# EAGLE design untitled (EAGLE 5.06)
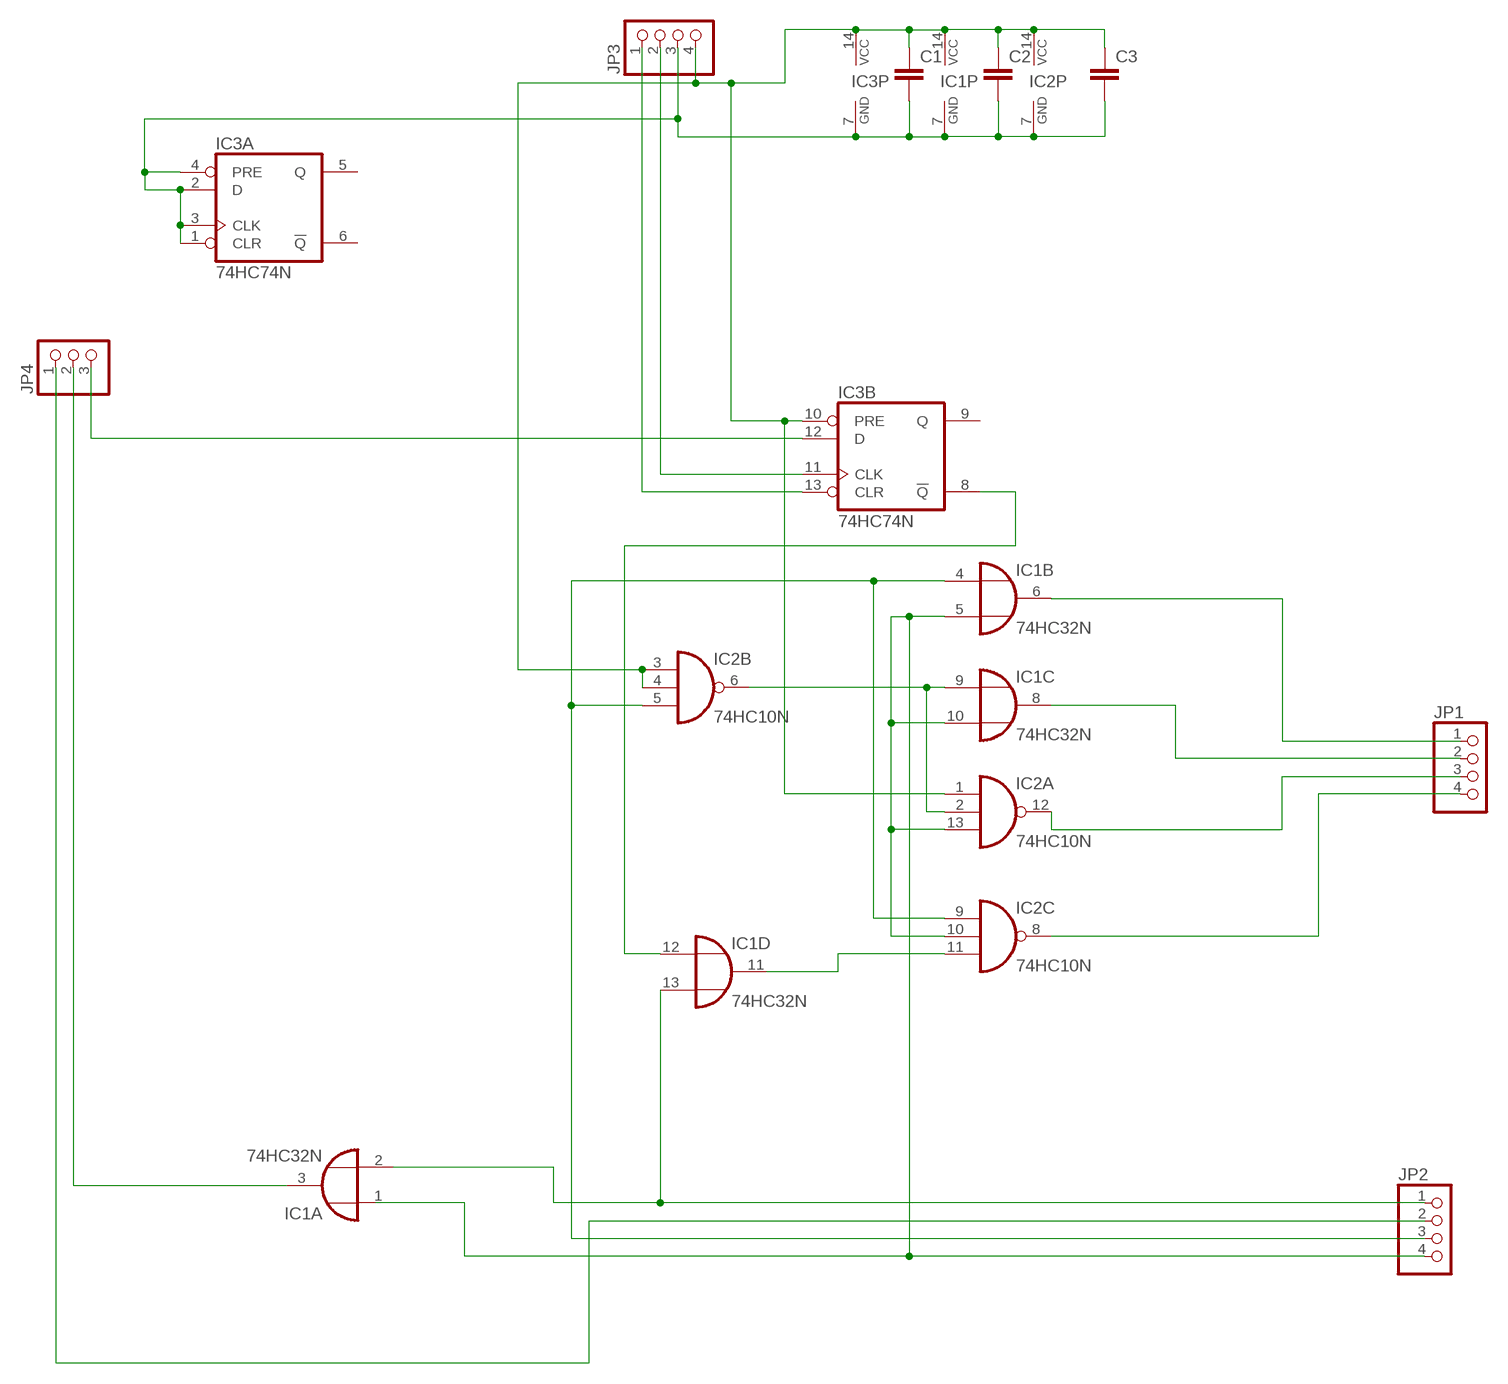
[diagram p0: schematic, sheet 1]

## Parts
C1  C-EU050-030X075  [C050-030X075]
C2  C-EU050-030X075  [C050-030X075]
C3  C-EU050-030X075  [C050-030X075]
IC1  74HC32N  [DIL14]
IC2  74HC10N  [DIL14]
IC3  74HC74N  [DIL14]
JP1  PINHD-1X4  [1X04]
JP2  PINHD-1X4  [1X04]
JP3  PINHD-1X4  [1X04]
JP4  PINHD-1X3  [1X03]

## Nets
N$1: JP2.2 JP4.1
N$2: C1.1 C2.1 C3.1 IC1.14(P:VCC) IC2.1(A:I0) IC2.3(B:I0) IC2.4(B:I1) IC2.14(P:VCC) IC3.10(B:PRE) IC3.14(P:VCC) JP3.4
N$3: C1.2 C2.2 C3.2 IC1.7(P:GND) IC2.7(P:GND) IC3.1(A:CLR) IC3.2(A:D) IC3.3(A:CLK) IC3.4(A:PRE) IC3.7(P:GND) JP3.3
N$4: IC3.11(B:CLK) JP3.2
N$5: IC3.13(B:CLR) JP3.1
N$6: IC3.12(B:D) JP4.3
N$7: IC1.2(A:I1) IC1.13(D:I1) JP2.1
N$8: IC1.3(A:O) JP4.2
N$10: IC1.6(B:O) JP1.1
N$11: IC1.8(C:O) JP1.2
N$12: IC2.12(A:O) JP1.3
N$13: IC2.8(C:O) JP1.4
N$14: IC1.9(C:I0) IC2.2(A:I1) IC2.6(B:O)
N$15: IC1.4(B:I0) IC2.5(B:I2) IC2.9(C:I0) JP2.3
N$16: IC1.12(D:I0) IC3.8(B:!Q)
N$18: IC1.5(B:I1) IC1.10(C:I1) IC2.10(C:I1) IC2.13(A:I2) JP2.4
N$25: IC1.11(D:O) IC2.11(C:I2)
Unconnected: IC1.1(A:I0) IC3.5(A:Q) IC3.6(A:!Q) IC3.9(B:Q)

## Library data of the parts
C1-C3 = resistor:C-EU: CAPACITOR, European symbol
IC1 = 74xx-eu:74*32: Quad 2-input OR gate
IC2 = 74xx-eu:74*10: Triple 3-input NAND gate
IC3 = 74xx-eu:74*74: Dual D type positive edge triggered FLIP FLOP, preset and clear
JP1-JP3 = pinhead:PINHD-1X4: PIN HEADER
JP4 = pinhead:PINHD-1X3: PIN HEADER

## Board
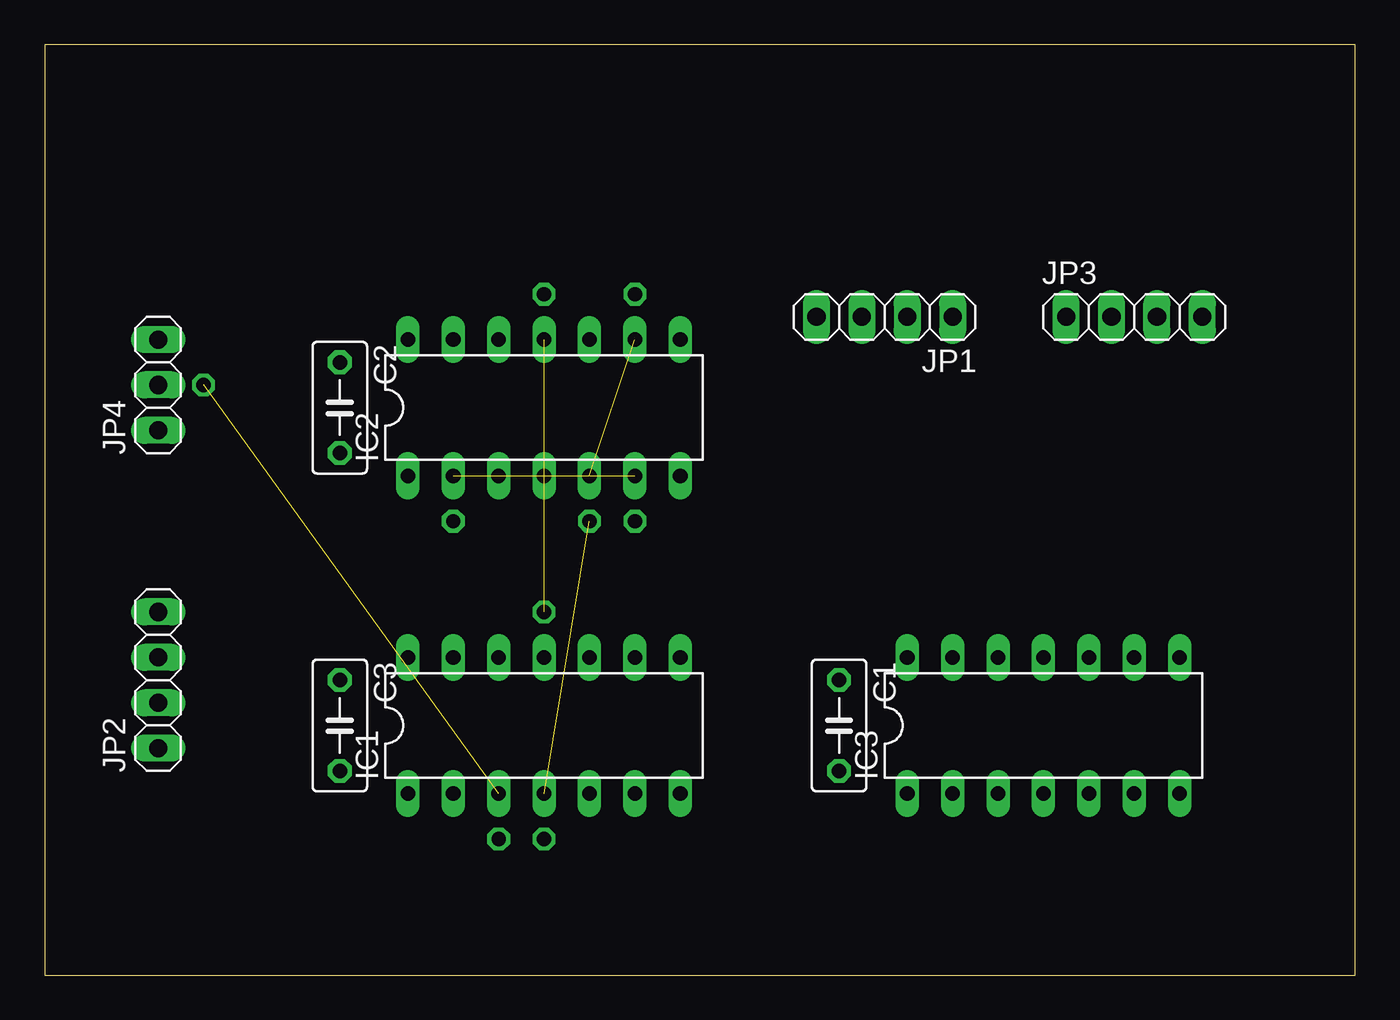
[diagram p1: board, top side]
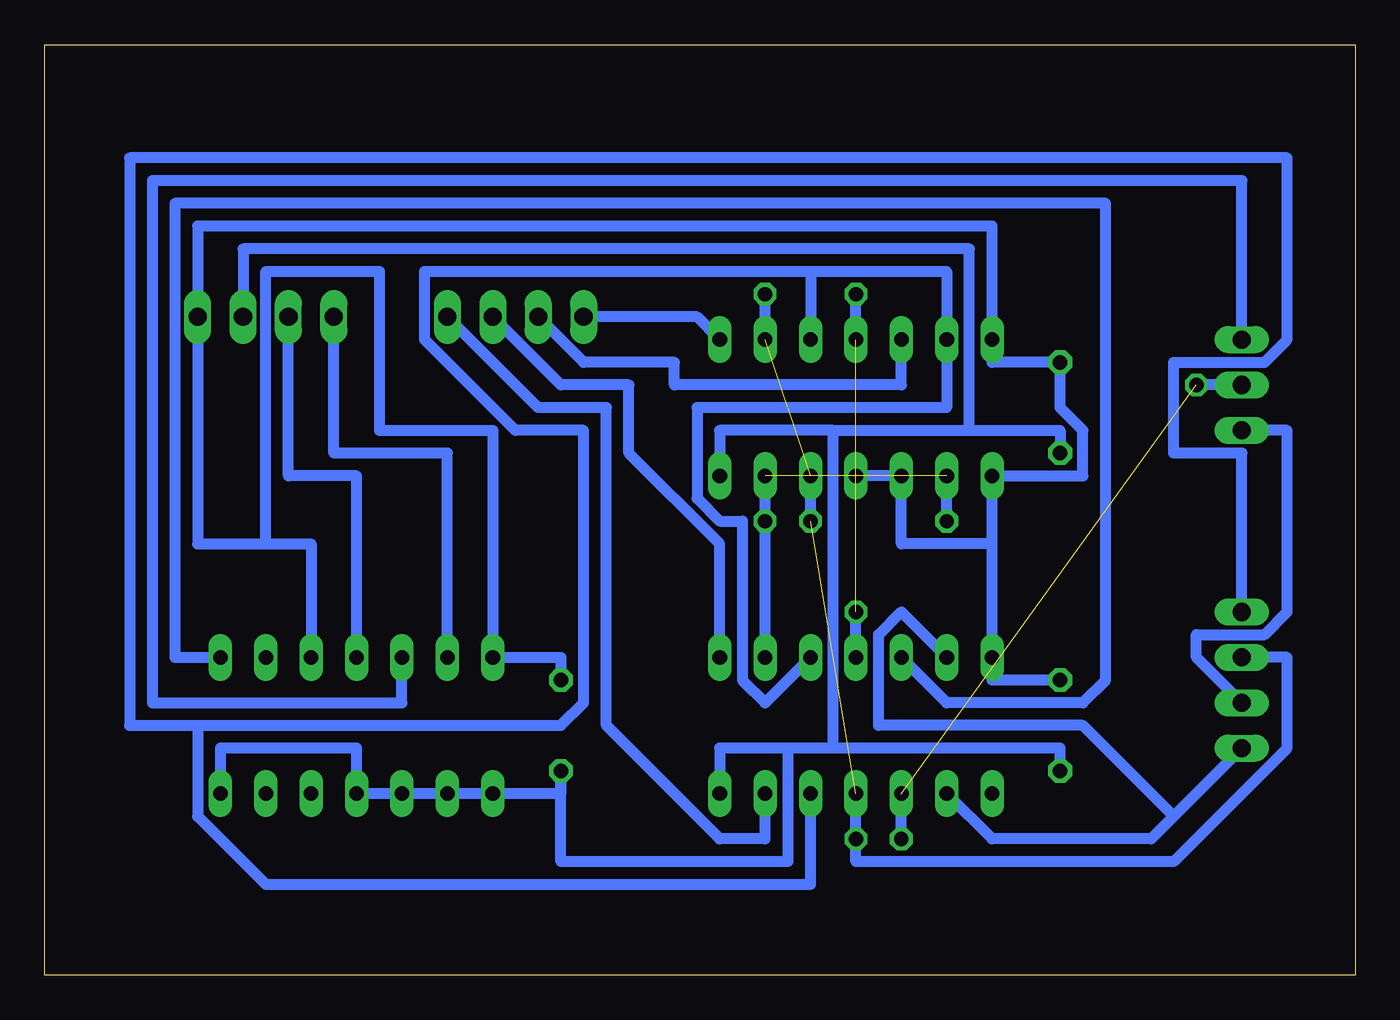
[diagram p2: board, bottom side, seen from below]

Size 73.33 x 52.06 mm. Coordinates in mm from the lower left corner, seen from the top.
Outline: 0,0 73.33,0 73.33,52.06 0,52.06 0,0
Copper layers (1*16): Top 0.035mm / dielectric 1.5mm / Bottom 0.035mm
Design rules "default": minimum track width 10mil, minimum drill 24mil, track to track 8mil, track to pad 8mil, pad to pad 8mil, via to via 8mil, smd to smd 8mil, copper to edge 40mil, drill to drill 8mil, minimum pad ring 10mil, minimum via ring 8mil, stop-mask expansion 4mil, vias tented up to drill 0mil, thermal gap 10mil

### Footprints (pad centres in the part's own frame; a part is rotated, then mirrored left to right if it is on the bottom)
C050-030X075 = drill 0.813 octagon: 1 -2.54,0; 2 2.54,0
DIL14 = drill 0.813 long: 1 -7.62,-3.81; 2 -5.08,-3.81; 3 -2.54,-3.81; 4 0,-3.81; 5 2.54,-3.81; 6 5.08,-3.81; 7 7.62,-3.81; 8 7.62,3.81; 9 5.08,3.81; 10 2.54,3.81; 11 0,3.81; 12 -2.54,3.81; 13 -5.08,3.81; 14 -7.62,3.81
1X04 = drill 1.016 long: 1 -3.81,0; 2 -1.27,0; 3 1.27,0; 4 3.81,0
1X03 = drill 1.016 long: 1 -2.54,0; 2 0,0; 3 2.54,0

### Placement (x,y rotation side)
C1  44.45,13.97 270 top
C2  16.51,31.75 270 top
C3  16.51,13.97 270 top
IC1  27.94,13.97 0 top
IC2  27.94,31.75 0 top
IC3  55.88,13.97 0 top
JP1  46.99,36.83 180 top
JP2  6.35,16.51 90 top
JP3  60.96,36.83 0 top
JP4  6.35,33.02 90 top

### Tracks (layer width: path | path; a pad name or v marks a point on that pad's centre or on a via)
N$1
  Bottom 0.61: JP2.2 8.89,17.78 8.89,19.05 5.08,19.05 3.81,20.32 3.81,30.48 JP4.1
N$2
  Bottom 0.61: C3.1 20.32,16.51 IC1.14 20.32,24.13 | C1.1 44.45,17.78 IC3.14 48.26,30.48 54.61,30.48 54.61,39.37 60.96,39.37 60.96,24.13 | IC2.4 IC2.3 25.4,24.13 20.32,24.13 | 20.32,24.13 IC2.1 15.24,27.94 15.24,30.48 16.51,31.75 C2.1 20.32,34.29 IC2.14 20.32,41.91 64.77,41.91 JP3.4 64.77,24.13 60.96,24.13 | 60.96,24.13 58.42,24.13 IC3.10
N$3
  Bottom 0.61: C2.2 16.51,30.48 21.59,30.48 | 29.21,30.48 21.59,30.48 | 29.21,30.48 35.56,30.48 IC2.7 | C3.2 16.51,12.7 29.21,12.7 | 29.21,12.7 31.75,12.7 | 31.75,12.7 35.56,12.7 IC1.7 | JP3.3 62.23,40.64 21.59,40.64 21.59,30.48 | 29.21,12.7 29.21,30.48 | 31.75,12.7 31.75,6.35 44.45,6.35 C1.2 44.45,10.16 IC3.1 | IC3.1 IC3.2 | IC3.2 IC3.3 | IC3.3 IC3.4 55.88,12.7 63.5,12.7 IC3.7 | IC3.1 IC3.2 | IC3.2 IC3.3
N$4
  Bottom 0.61: JP3.2 59.69,27.94 55.88,27.94 IC3.11
N$5
  Bottom 0.61: JP3.1 57.15,29.21 50.8,29.21 IC3.13
N$6
  Bottom 0.61: IC3.12 53.34,15.24 67.31,15.24 67.31,44.45 6.35,44.45 JP4.3
N$7
  Bottom 0.61: IC1.2 20.32,7.62 11.43,7.62 10.16,8.89 | JP2.1 10.16,8.89 | IC1.13 25.4,20.32 26.67,19.05 26.67,13.97 15.24,13.97 10.16,8.89
N$8  (via drill 0.8 pad 1.27)  (1 unrouted)
  Bottom 0.61: v25.4,7.62 IC1.3 | JP4.2 v8.89,33.02 JP4.2
N$10
  Bottom 0.61: JP1.1 45.72,31.75 41.91,31.75 41.91,13.97 35.56,7.62 33.02,7.62 IC1.6
N$11
  Bottom 0.61: IC1.8 35.56,24.13 40.64,29.21 40.64,33.02 44.45,33.02 JP1.2
N$12
  Bottom 0.61: IC2.12 25.4,33.02 38.1,33.02 38.1,34.29 43.18,34.29 JP1.3
N$13
  Bottom 0.61: IC2.8 36.83,36.83 JP1.4
N$14  (via drill 0.8 pad 1.27)  (1 unrouted)
  Bottom 0.61: IC1.9 v33.02,25.4 IC2.6 | v22.86,25.4 IC2.2
N$15  (via drill 0.8 pad 1.27)  (2 unrouted)
  Bottom 0.61: IC1.4 v27.94,7.62 27.94,6.35 10.16,6.35 3.81,12.7 3.81,17.78 JP2.3 | v30.48,25.4 IC2.5 | IC2.9 v33.02,38.1
N$16
  Bottom 0.61: IC1.12 22.86,15.24 15.24,15.24 13.97,16.51 13.97,43.18 66.04,43.18 66.04,17.78 IC3.8
N$18
  Bottom 0.61: 30.48,39.37 22.86,39.37 IC2.13 22.86,31.75 36.83,31.75 36.83,26.67 35.56,25.4 34.29,25.4 34.29,16.51 33.02,15.24 IC1.10 | 30.48,39.37 IC2.10 | IC1.5 30.48,5.08 60.96,5.08 64.77,8.89 64.77,13.97 | 64.77,13.97 44.45,13.97 43.18,15.24 43.18,30.48 46.99,30.48 52.07,35.56 52.07,39.37 30.48,39.37 | JP2.4 6.35,29.21 10.16,29.21 10.16,34.29 5.08,34.29 3.81,35.56 3.81,45.72 68.58,45.72 68.58,13.97 64.77,13.97
N$25  (via drill 0.8 pad 1.27)  (1 unrouted)
  Bottom 0.61: IC2.11 v27.94,38.1 | IC1.11 v27.94,20.32